# Altium schematic sheet power3v3.SchDoc
size A
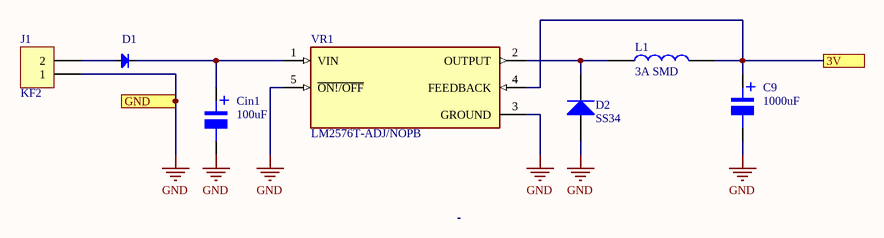
[diagram p0: power3v3.SchDoc]

## Parts
C9  1000uF  [tu nhom 10 (G)]
Cin1  100uF  [tu nhom 6.3 (d)]
D1  Diode  [DIO-3A]  (value not drawn)
D2  SS34  [DIODE SMA]
J1  KF2  [KF2-3.5]
L1  3A SMD  [Cuon Cam 12x12x10]
VR1  LM2576T-ADJ/NOPB  [TO170P1067X483X1651-5]

## Ports
3V, GND

## Nets
GND: C9.2 Cin1.2 D2.1(A) J1.1 VR1.3(GROUND) VR1.5(~{ON!/OFF}) ; port GND
3V: C9.1 L1.2 VR1.4(FEEDBACK) ; port 3V
NetCin1_1: Cin1.1 D1.2(K) VR1.1(VIN)
NetD1_1: D1.1(A) J1.2
NetD2_2: D2.2(K) L1.1 VR1.2(OUTPUT)

## Notes on the sheet
- (in symbol Tu Nhom 100uF 16V) +
- (in symbol Tu Nhom 1000uF 10V) +

## Library data of the parts
C9 = Tu Nhom 1000uF 10V: Dán; So_Chan: 2; Don_Vi: Con; Ten_Linh_Kien: Tụ Nhôm 1000uF 10V; Ma_Hang: MH007515; Chung_Loai: Dán; Kieu_Chan: *
Cin1 = Tu Nhom 100uF 16V: Dán; Don_Vi: Con; So_Chan: 2; Ten_Linh_Kien: Tụ Nhôm 100uF 16V 6.3x5.4MM; Ma_Hang: MH002219; Chung_Loai: Dán; Kieu_Chan: *
D1 = Diode: Default Diode; Code - JEDEC: DO-214-AB; Value: 1N5007; Published: 8-Jun-2000; Revision: July-2002: Re-released for DXP Platform.; Publisher: Altium Limited
D2 = Diode SS34 ( 1N5822 ): Dán; Don_Vi: Con; Ma_Hang: MH002104; Ten_Linh_Kien: Diode SS34 3A 40V SMA ( 1N5822 SS34A); Kieu_Chan: *; Chung_Loai: Dán
J1 = KF2: Manufacturer: Würth Elektronik eiSos GmbH; partNo: 691103110002; ComponentLink1 Description: Manufacturer; ComponentLink2 Description: Datasheet; NoPins: 2; Created Date: 29 October 2013; ComponentLink1URL: http://www.we-online.com; ComponentLink2URL: http://katalog.we-online.de/em/datasheet/6911031100xx.pdf; Created by: Karrer Zheng
L1 = CUON CAM 100uH SMD: Dán; Don_Vi: Con; Ma_Hang: MH003999; Ten_Linh_Kien: Cuộn Cảm 100uH 7x7x4MM CD74; Ma_Hang: *; Kieu_Chan: *; Chung_Loai: Dán
VR1 = LM2576T-ADJ/NOPB: SIMPLE SWITCHERÂ® 40V, 3A Low Component Count Step-Down Regulator; Package: None; Value: *; MP: LM2576T-ADJ/NOPB; Availability: Unavailable; Price: None